# Altium schematic sheet MAIN.SchDoc
size B
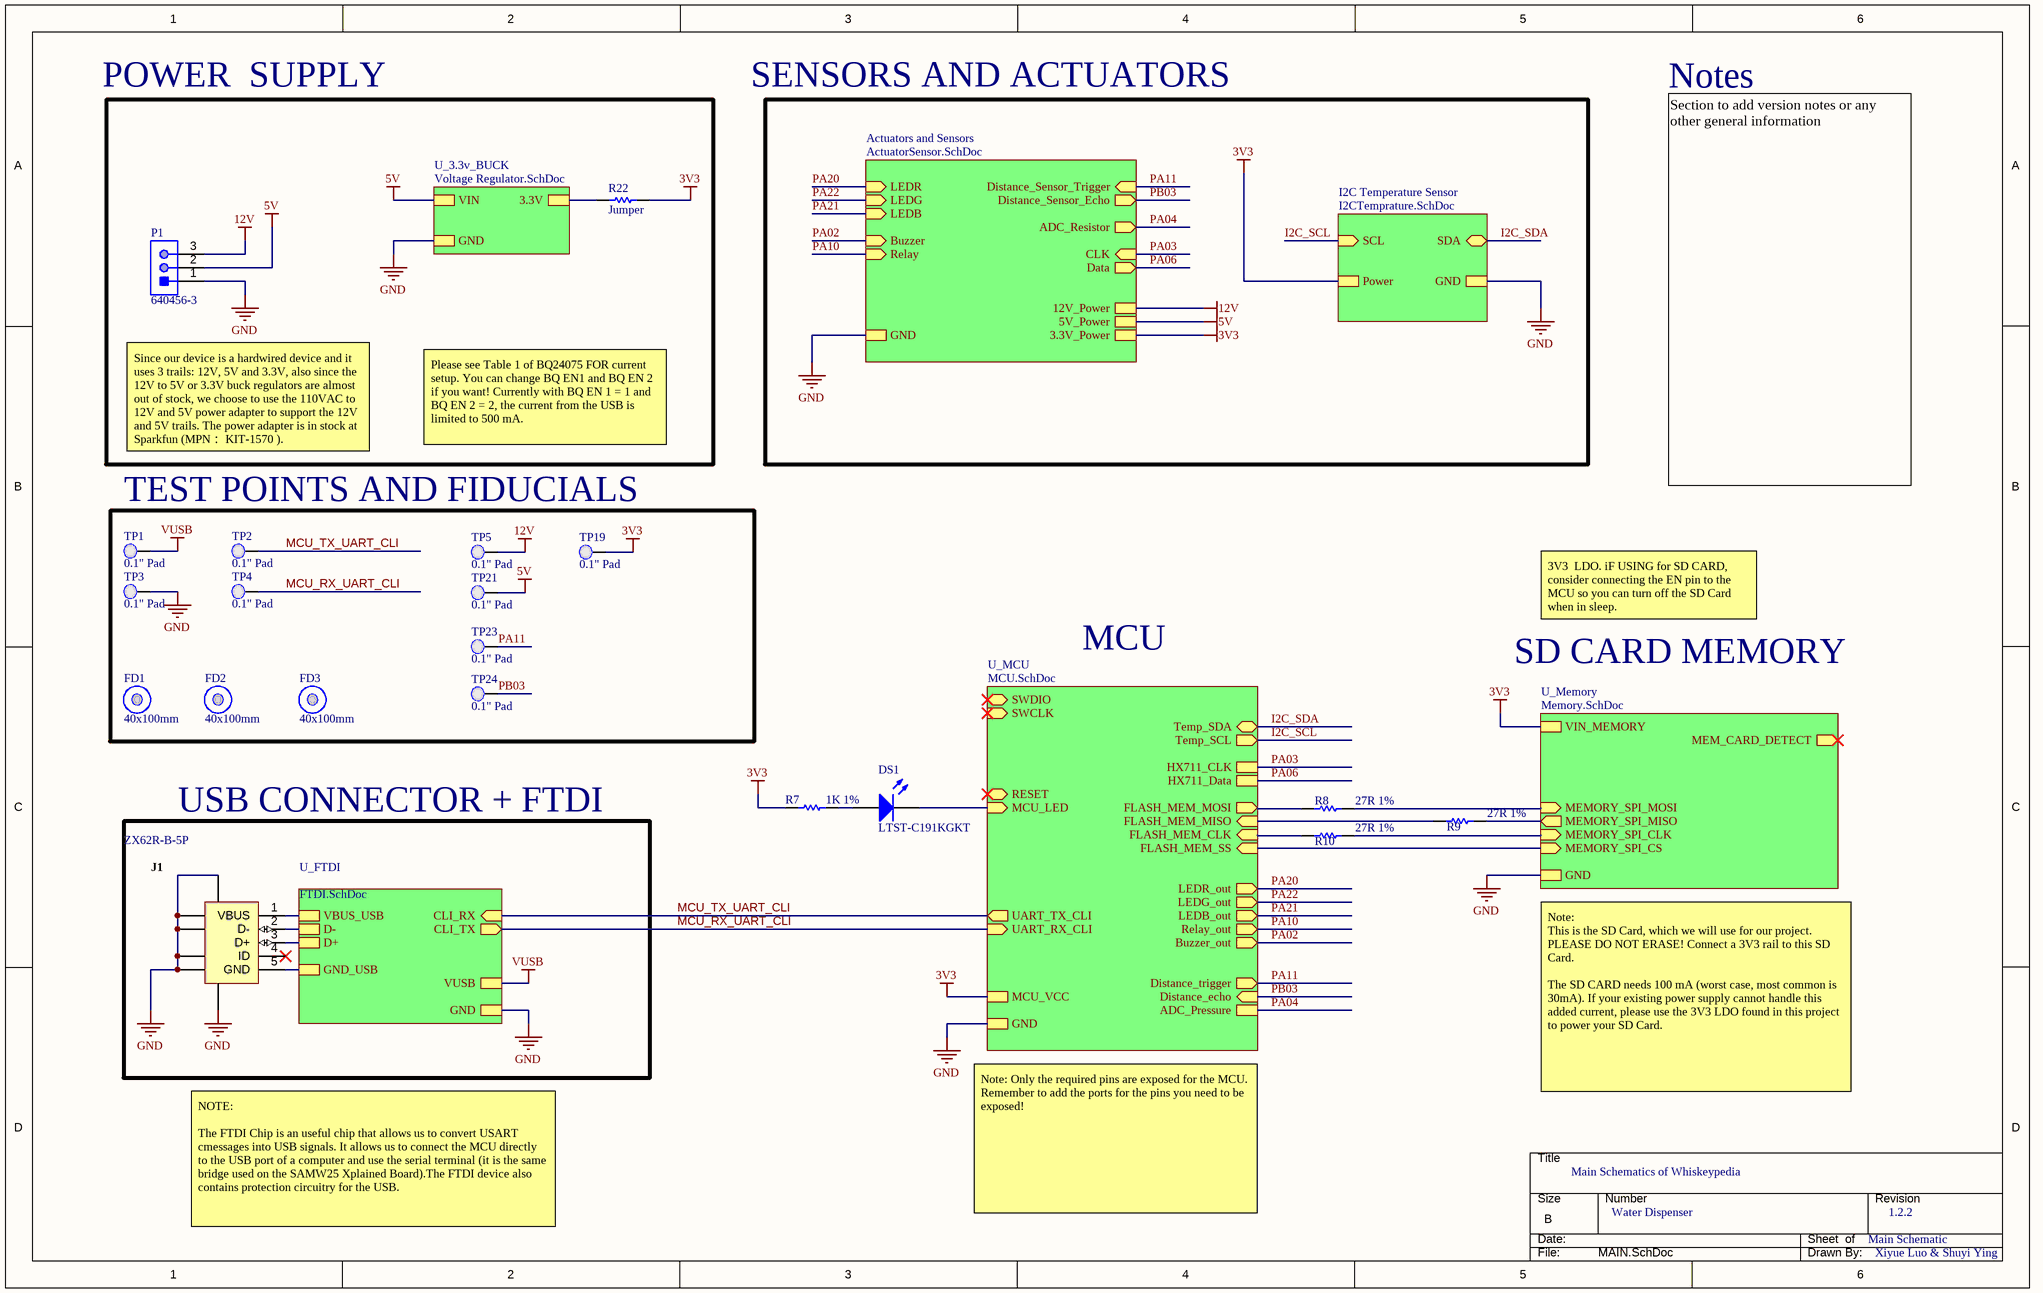
[diagram p0: MAIN.SchDoc]

## Parts
DS1  LTST-C191KGKT  [LITE-ON-LTST-C191KRKT-2_V]
FD1  40x100mm  [Fiducial_FT]  (no BOM)
FD2  40x100mm  [Fiducial_FT]  (no BOM)
FD3  40x100mm  [Fiducial_FT]  (no BOM)
J1  ZX62R-B-5P  [HIRO-ZX62R-B-5P_V]
P1  640456-3  [TECO-640456-3]
R7  1K 1%  [RESC0603(1608)_N]
R8  27R 1%  [RESC1005X40X25NL10T10]
R9  27R 1%  [RESC1005X40X25NL10T10]
R10  27R 1%  [RESC1005X40X25NL10T10]
R22  Jumper  [RESC0805(2012)_N]
TP1  0.1" Pad  [PCBComponent]  (no BOM)
TP2  0.1" Pad  [PCBComponent]  (no BOM)
TP3  0.1" Pad  [PCBComponent]  (no BOM)
TP4  0.1" Pad  [PCBComponent]  (no BOM)
TP5  0.1" Pad  [PCBComponent]  (no BOM)
TP19  0.1" Pad  [PCBComponent]  (no BOM)
TP21  0.1" Pad  [PCBComponent]  (no BOM)
TP23  0.1" Pad  [PCBComponent]  (no BOM)
TP24  0.1" Pad  [PCBComponent]  (no BOM)

## Blocks framed on the sheet
TEST POINTS AND FIDUCIALS: FD1-FD3 TP1-TP5 TP19 TP21 TP23 TP24
USB CONNECTOR + FTDI: J1

## Sub-sheets
Actuators and Sensors = ActuatorSensor.SchDoc: LEDR (in), LEDG (in), LEDB (in), Buzzer (in), Relay (in), Distance_Sensor_Trigger (in), Distance_Sensor_Echo (out), GND, 5V_Power, 3.3V_Power, 12V_Power, ADC_Resistor (out), CLK (in), Data (out)
I2C Temperature Sensor = I2CTemprature.SchDoc: SCL (in), Power, SDA (bidir), GND
U_3.3v_BUCK = Voltage Regulator.SchDoc: VIN, 3.3V, GND
U_FTDI = FTDI.SchDoc: CLI_RX (in), CLI_TX (out), VUSB, GND, VBUS_USB, D-, D+, GND_USB
U_MCU = MCU.SchDoc: SWDIO (bidir), SWCLK (in), UART_TX_CLI (out), UART_RX_CLI (in), FLASH_MEM_SS (in), FLASH_MEM_CLK (in), FLASH_MEM_MISO (in), FLASH_MEM_MOSI (out), RESET (bidir), MCU_LED (in), MCU_VCC, GND, LEDR_out (out), LEDG_out (out), LEDB_out (out), Relay_out (out), Buzzer_out (out), Distance_trigger (out), Distance_echo (in), Temp_SDA (bidir), Temp_SCL (out), ADC_Pressure, HX711_CLK, HX711_Data
U_Memory = Memory.SchDoc: MEMORY_SPI_MOSI (in), MEMORY_SPI_MISO (out), MEMORY_SPI_CLK (in), MEMORY_SPI_CS (in), MEM_CARD_DETECT (out), VIN_MEMORY, GND

## Nets
3V3: R7.1 R22.2 TP19.1(PAD) ; sheet U_MCU/MCU_VCC, sheet U_Memory/VIN_MEMORY, sheet Actuators and Sensors/3.3V_Power, sheet I2C Temperature Sensor/Power
5V: P1.2 TP21.1(PAD) ; sheet U_3.3v_BUCK/VIN, sheet Actuators and Sensors/5V_Power
12V: P1.3 TP5.1(PAD) ; sheet Actuators and Sensors/12V_Power
GND: J1.6(SHLD) J1.7(SHLD) J1.8(SHLD) J1.9(SHLD) J1.10(SHLD) J1.11(SHLD) P1.1 TP3.1(PAD) ; sheet U_FTDI/GND, sheet U_MCU/GND, sheet U_Memory/GND, sheet U_3.3v_BUCK/GND, sheet Actuators and Sensors/GND, sheet I2C Temperature Sensor/GND
VUSB: TP1.1(PAD) ; sheet U_FTDI/VUSB
I2C_SCL: sheet U_MCU/Temp_SCL, sheet I2C Temperature Sensor/SCL
I2C_SDA: sheet U_MCU/Temp_SDA, sheet I2C Temperature Sensor/SDA
MCU_RX_UART_CLI: TP4.1(PAD) ; sheet U_FTDI/CLI_TX, sheet U_MCU/UART_RX_CLI
MCU_TX_UART_CLI: TP2.1(PAD) ; sheet U_FTDI/CLI_RX, sheet U_MCU/UART_TX_CLI
PA02: sheet U_MCU/Buzzer_out, sheet Actuators and Sensors/Buzzer
PA03: sheet U_MCU/HX711_CLK, sheet Actuators and Sensors/CLK
PA04: sheet U_MCU/ADC_Pressure, sheet Actuators and Sensors/ADC_Resistor
PA06: sheet U_MCU/HX711_Data, sheet Actuators and Sensors/Data
PA10: sheet U_MCU/Relay_out, sheet Actuators and Sensors/Relay
PA11: TP23.1(PAD) ; sheet U_MCU/Distance_trigger, sheet Actuators and Sensors/Distance_Sensor_Trigger
PA20: sheet U_MCU/LEDR_out, sheet Actuators and Sensors/LEDR
PA21: sheet U_MCU/LEDB_out, sheet Actuators and Sensors/LEDB
PA22: sheet U_MCU/LEDG_out, sheet Actuators and Sensors/LEDG
PB03: TP24.1(PAD) ; sheet U_MCU/Distance_echo, sheet Actuators and Sensors/Distance_Sensor_Echo
NetDS1_1: DS1.1(A) R7.2
NetDS1_2: DS1.2(K) ; sheet U_MCU/MCU_LED
NetJ1_1: J1.1(VBUS) ; sheet U_FTDI/VBUS_USB
NetJ1_2: J1.2(D-) ; sheet U_FTDI/D-
NetJ1_3: J1.3(D+) ; sheet U_FTDI/D+
NetJ1_5: J1.5(GND) ; sheet U_FTDI/GND_USB
NetR8_1: R8.1 ; sheet U_MCU/FLASH_MEM_MOSI
NetR8_2: R8.2 ; sheet U_Memory/MEMORY_SPI_MOSI
NetR9_1: R9.1 ; sheet U_MCU/FLASH_MEM_MISO
NetR9_2: R9.2 ; sheet U_Memory/MEMORY_SPI_MISO
NetR10_1: R10.1 ; sheet U_MCU/FLASH_MEM_CLK
NetR10_2: R10.2 ; sheet U_Memory/MEMORY_SPI_CLK
NetR22_1: R22.1 ; sheet U_3.3v_BUCK/3.3V
(unnamed): sheet U_MCU/FLASH_MEM_SS, sheet U_Memory/MEMORY_SPI_CS

Not connected (* = marked no-connect by the designer): J1 4(ID)*

## Notes on the sheet
- POWER  SUPPLY
- SENSORS AND ACTUATORS
- Notes
- Since our device is a hardwired device and it uses 3 trails: 12V, 5V and 3.3V, also since the 12V to 5V or 3.3V buck regulators are almost out of stock, we choose to use the 110VAC to 12V and 5V power adapter to support the 12V and 5V trails. The power adapter is in stock at Sparkfun (MPN： KIT-1570 ).
- Please see Table 1 of BQ24075 FOR current setup. You can change BQ EN1 and BQ EN 2 if you want! Currently with BQ EN 1 = 1 and BQ EN 2 = 2, the current from the USB is limited to 500 mA.
- Section to add version notes or any other general information
- 3V3  LDO. iF USING for SD CARD, consider connecting the EN pin to the MCU so you can turn off the SD Card when in sleep.
- MCU
- SD CARD MEMORY
- Note:
  This is the SD Card, which we will use for our project. PLEASE DO NOT ERASE! Connect a 3V3 rail to this SD Card.
  The SD CARD needs 100 mA (worst case, most common is 30mA). If your existing power supply cannot handle this added current, please use the 3V3 LDO found in this project to power your SD Card.
- Main Schematics of Whiskeypedia
- NOTE:
  The FTDI Chip is an useful chip that allows us to convert USART cmessages into USB signals. It allows us to connect the MCU directly to the USB port of a computer and use the serial terminal (it is the same bridge used on the SAMW25 Xplained Board).The FTDI device also contains protection circuitry for the USB.
- Note: Only the required pins are exposed for the MCU. Remember to add the ports for the pins you need to be exposed!
- Water Dispenser
- Main Schematic
- 1.2.2
- Xiyue Luo & Shuyi Ying

## Library data of the parts
DS1 = CMP-2000-05198-1: Chip LED, Green, 574 nm, 40 pF, -55 to 85 degC, 2-Pin SMD, RoHS, Tape and Reel; Manufacturer: Lite-On; Rad Hardened: No; Emitting Color: YellowGreen; Product Height (mm): 0.55mm; Forward Voltage: 2.4V; Number of Elements: 1; Dominant Wave Length: 571nm; DELETED: Compliant; Viewing Angle: 130deg; High Brightness: Yes; Peak Wavelength: 574nm; Type: Uni-Color; Forward Current: 30mA; Product Length (mm): 1.6mm; Luminous Intensity: 35mcd; Test Current (It): 20mA; Chip Material: AlGaInP; Product Depth (mm): 0.8mm; Shape Type: Rectangular; Reverse Voltage: 5V; Power Dissipation: 75W; Pin Count: 2; Lens Dimensions: 1.1X0.8X0.37mm; Packaging: TapeandReel; Main Category: ChipLED; Operating Temperature Classification: Industrial; Package Type: ChipLed; Mounting: SurfaceMount; Lum Intensity: 35mcd; Operating Temp Range: -55Cto85C; Datasheet Version: Jan-07; Datasheet URL: http://download.siliconexpert.com/pdfs/2007/08/26/semi_b/manual/lot/ds/ltst-c191kgkt.pdf; Manufacturer URL: http://www.us.liteon.com/
FD1-FD3 = CMP-00174-A.4: Fiducial 40x100mm
J1 = CMP-0031-00001-1: Connector; USBMicro-B,Reverse type, SMT; 5 Position; Right Angle; DatasheetVersion: 08/2010; Operating Temperature: -30 to 85 degC; Mounting Technology: Surface Mount; PartNumber: ZX62R-B-5P; PackageReference: ZX62R-B-5P; ComponentLink2URL: http://www.hirose.co.jp/cataloge_hp/e24200011.pdf; ComponentLink1URL: http://www.hirose.com/â€Ž; ComponentLink2Description: Datasheet; PackageDescription: 5-Pin USB Micro-B R/A Connector; ComponentLink1Description: Manufacturer URL
P1 = CMP-2000-05418-1: Male Header, Pitch 2.54 mm, 1 x 3 Position, Height 10.03 mm, Tail Length 3.56 mm, -55 to 105 degC; Manufacturer: TE Connectivity; Agency Approvals: CSA,UL; Angle: Straight; Number of Positions: 3; Standards: RoHSCompliant,ELVCompliant,UL94V-0; Current, Rating: 5 / A; Connector Type: MTA-100; Mount Angle: Vertical; Material, Housing: Polyester; Temperature, Operating: -55to+105 / degC; Voltage, Rating: 250 / V; Color, Housing: White; Contact Centerline Spacing: 0.100 / in.; Special Features: Pinstrip; Material, Contact: CopperAlloy; Contact Termination Area Plating: Tin; Primary Type: InterconnectSystem; Pin Spacing: 0.1 / "; Brand/Series: MTA-100Series; Mounting Hole Size: 0.04 / "; Manufacturer URL: http://www.te.com/; Datasheet URL: https://datasheet.ciiva.com/16456/eng-ds-82056-mta-0608-16456886.pdf; Flammability Rating: UL94V-0; Mounting Type: PCMount; Contact Mating Area Plating: Tin; Datasheet Version: Jun-08; Number of Rows: 1; Termination: Solder; Type: PCBPlug; Length, Pin: 0.14 / "; Color: White; Contact Plating: Tin; Contact Shape: Square; Number of Contacts: 3; Size, Post: 0.025 / in.; Length, Terminal Post: 0.14 / in.; Length, Overall: 0.3 / "
R7 = CMP-1012-00510-1: 1K 0.1W 1% 0603 (1608 Metric)  SMD; Case-Metric: 1608; Case-EIA: 0603; Value: 1000.00 Ohm; Technology: SMT; Tolerance: 1 %; Power: 0.1 W
R8-R10 = CMP-2002-06087-1: Manufacturer: Multicomp; Part Number: MC00625W0402127R
R22 = CMP-1013-00001-1: Jumper 0805 (2012 Metric); Case-EIA: 0805; Value: 0.00 Ohm; Tolerance: None; Case-Metric: 2012; Technology: SMT; Power: None
TP1-TP5 TP19 TP21 TP23 TP24 = 0.1" Pad-A.4